# EAGLE design Venus_GPS_logger-sma (EAGLE 6.5.0)
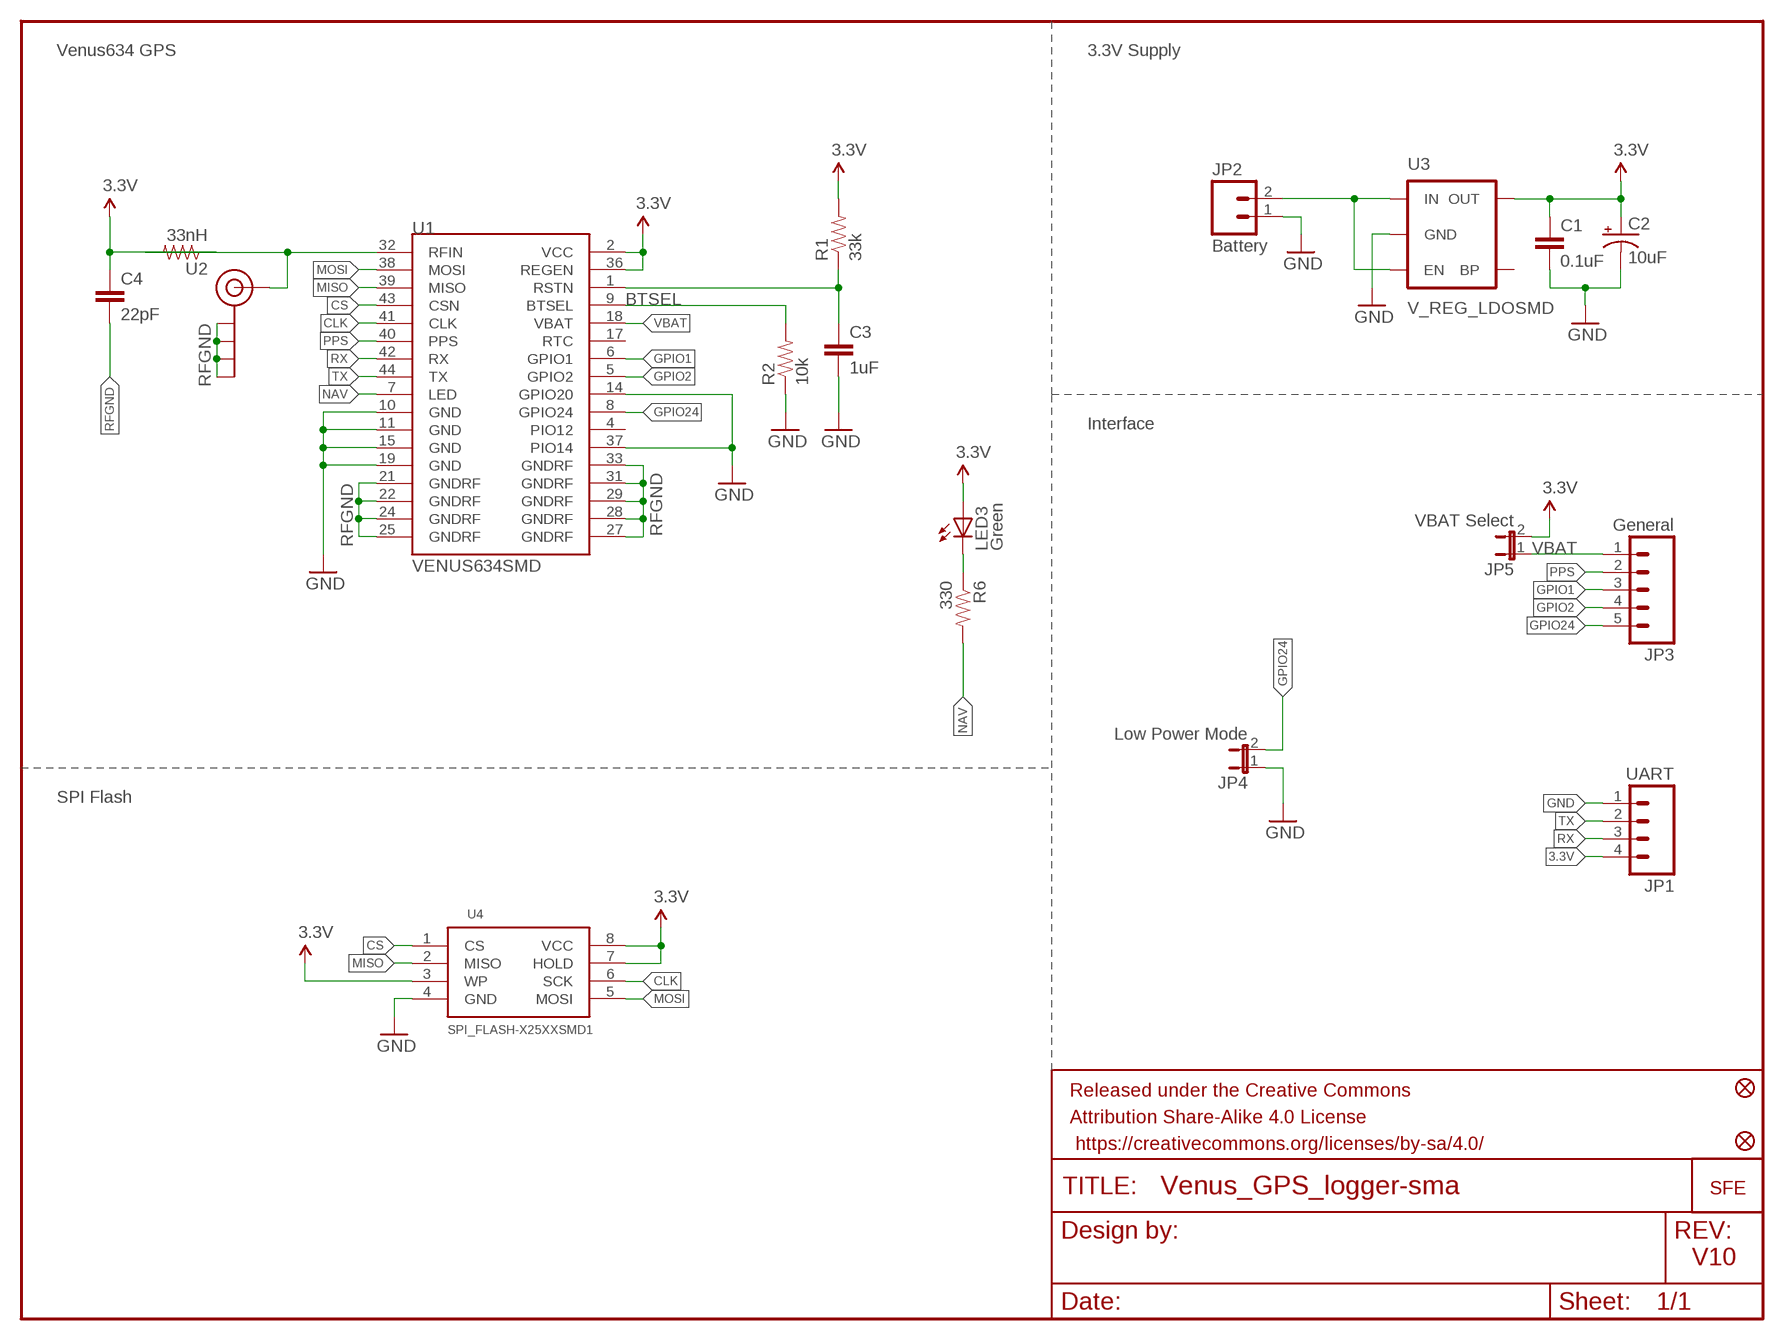
[diagram p0: schematic, sheet 1]

## Parts
C1  0.1uF  0.1UF-25V(+80/-20%)(0603)  [0603-CAP]
C2  10uF  CAP_POL1206  [EIA3216]
C3  1uF  1.0UF-16V-10%(0603)  [0603-CAP]
C4  22pF  22PF-50V-5%(0603)  [0603-CAP]
FID1  FIDUCIAL1X2  [FIDUCIAL-1X2]
FID2  FIDUCIAL1X2  [FIDUCIAL-1X2]
FRAME1  FRAME-LETTER  [CREATIVE_COMMONS]
J$1  SMA_EDGE  [SMA-EDGE]
JP1  UART  M04PTH  [1X04]
JP2  Battery  M02-JST-2MM-SMT  [S2B-PH]
JP3  General  M05PTH  [1X05]
JP4  Low Power Mode  JUMPER-2SMD-NC  [SJ_2S]
JP5  VBAT Select  JUMPER-2SMD-NC  [SJ_2S]
LED3  Green  LED-GREEN0603  [LED-0603]
R1  33k  33KOHM1/10W1%(0603)  [0603-RES]
R2  10k  10KOHM1/10W1%(0603)0603  [0603-RES]
R6  330  330OHM1/10W1%(0603)  [0603-RES]
U1  VENUS634SMD  [LGA44]
U2  33nH  33NH  [0603-RES]
U3  V_REG_LDOSMD  [SOT23-5]
U4  SPI_FLASH-X25XXSMD1  [SO08-EIAJ]
U$1  LOGO-SFESK  [SFE-LOGO-FLAME]

## Nets
3.3V: C1.1 C2.A(+) C4.1 JP1.4 JP5.2 LED3.A R1.2 U1.2(VCC) U1.36(REGEN) U2.1 U3.5(OUT) U4.3(WP) U4.7(HOLD) U4.8(VCC)
BTSEL: R2.2 U1.9(BTSEL)
CLK: U1.41(CLK) U4.6(SCK)
CS: U1.43(CSN) U4.1(CS)
GND: C1.2 C2.C(-) C3.2 JP1.1 JP2.1 JP4.1 R2.1 U1.10(GND) U1.11(GND) U1.14(GPIO20) U1.15(GND) U1.19(GND) U1.37(PIO14) U3.2(GND) U4.4(GND)
GPIO1: JP3.3 U1.6(GPIO1)
GPIO2: JP3.4 U1.5(GPIO2)
GPIO24: JP3.5 JP4.2 U1.8(GPIO24)
MISO: U1.39(MISO) U4.2(MISO)
MOSI: U1.38(MOSI) U4.5(MOSI)
N$1: LED3.C R6.1
N$3: C3.1 R1.1 U1.1(RSTN)
N$14: J$1.SIG(SIGNAL) U1.32(RFIN) U2.2
NAV: R6.2 U1.7(LED)
PPS: JP3.2 U1.40(PPS)
RFGND: C4.2 J$1.GND@0(GND) J$1.GND@1(GND) J$1.GND@2(GND) J$1.GND@3(GND) U1.21(GNDRF) U1.22(GNDRF) U1.24(GNDRF) U1.25(GNDRF) U1.27(GNDRF) U1.28(GNDRF) U1.29(GNDRF) U1.31(GNDRF) U1.33(GNDRF)
RX: JP1.3 U1.42(RX)
TX: JP1.2 U1.44(TX)
VBAT: JP3.1 JP5.1 U1.18(VBAT)
VBATT: JP2.2 U3.1(IN) U3.3(EN)
Unconnected: U1.4(PIO12) U1.17(RTC) U3.4(BP)

## Notes on the sheet
- Venus634 GPS | 3.3V Supply
- Interface
- SPI Flash
- V10

## Library data of the parts
C1 = SparkFun-Capacitors:0.1UF-25V(+80/-20%)(0603): CAP-00810 Ceramic Standard decoupling cap; PROD_ID: CAP-00810
C2 = SparkFun:CAP_POL: Capacitor Polarized These are standard SMD and PTH capacitors. Normally 10uF, 47uF, and 100uF in electrolytic and tantalum varieties. Always verify the external diameter of the through hole cap, it varies with capacity, voltage, and manufacturer. The EIA devices should be standard.
C3 = SparkFun-Capacitors:1.0UF-16V-10%(0603): CAP-00868; PROD_ID: CAP-00868; VALUE: 1.0uF
C4 = SparkFun-Capacitors:22PF-50V-5%(0603): CAP-07876; PROD_ID: CAP-07876
FID1 FID2 = SparkFun-Aesthetics:FIDUCIAL: Fiducial Alignment Points Various fiducial points for machine vision alignment.
FRAME1 = SparkFun-Aesthetics:FRAME-LETTER: Schematic Frame Standard 8.5x11 US Letter frame
J$1 = SparkFun:SMA_EDGE: SMA Antenna Connector End launch SMA connector. The paste layer has been removed so that the connector can be hand soldered onto the board after reflow.
JP1 = SparkFun-Connectors:M04: Header 4 Standard 4-pin 0.1" header. Use with straight break away headers (SKU : PRT-00116), right angle break away headers (PRT-00553), swiss pins (PRT-00743), machine pins (PRT-00117), and female headers (PRT-00115). Molex polarized connector foot print use with SKU : PRT-08231 with associated crimp pins and housings. 1MM SMD Version SKU: PRT-10208
JP2 = SparkFun:M02: Header 2 Standard 2-pin 0.1" header. Use with straight break away headers (SKU : PRT-00116), right angle break away headers (PRT-00553), swiss pins (PRT-00743), machine pins (PRT-00117), and female headers (PRT-00115). Molex polarized connector foot print use with SKU : PRT-08233 with associated crimp pins and housings.
JP3 = SparkFun-Connectors:M05: Header 5 Standard 5-pin 0.1" header. Use with straight break away headers (SKU : PRT-00116), right angle break away headers (PRT-00553), swiss pins (PRT-00743), machine pins (PRT-00117), and female headers (PRT-00115). Molex polarized connector foot print use with SKU : PRT-08230 with associated crimp pins and housings.
JP4 JP5 = SparkFun-Passives:JUMPER-2: Jumper Basic 0.1" spaced jumper. Use with breakaway headers.
LED3 = SparkFun-LED:LED-GREEN: Various green LEDs Green LEDs used in SFE Production 0603- DIO-00821 LARGE- DIO-00862 LILYPAD- DIO-09910; PROD_ID: DIO-00821; VALUE: GREEN
R1 = SparkFun-Resistors:33KOHM1/10W1%(0603): RES-08416
R2 = SparkFun-Resistors:10KOHM1/10W1%(0603): RES-00824; PROD_ID: RES-00824; VALUE: 10K
R6 = SparkFun-Resistors:330OHM1/10W1%(0603): RES-00818; PROD_ID: RES-00818
U1 = SparkFun:VENUS634: Venus634 from SkyTraq
U2 = SparkFun-Resistors:33NH; PROD_ID: NDUC-07874
U3 = SparkFun:V_REG_LDO: Voltage Regulator LDO Standard 150mA LDO voltage regulator in SOT-23 layout. Micrel part MIC5205. BP (by-pass) pin is used to lower output noise with 470pF cap.
U4 = SparkFun:SPI_FLASH-X25XX: 8pin SPI Flash series x25xx. Works with devices like W25X32 and BR25L32
U$1 = SparkFun:LOGO-SFE: Spark Fun Electronics PCB Logo This is the standard Spark Fun Electronics PCB logo.

## Board
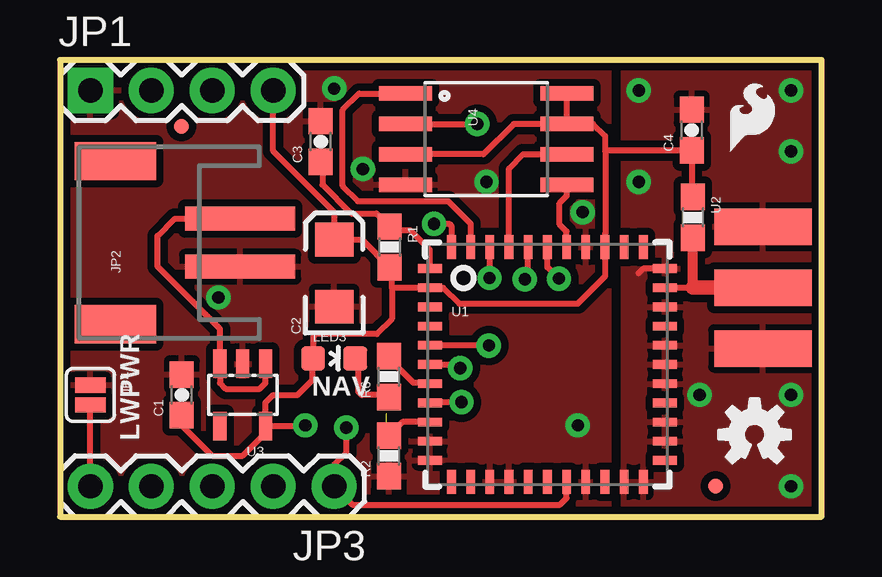
[diagram p1: board, top side]
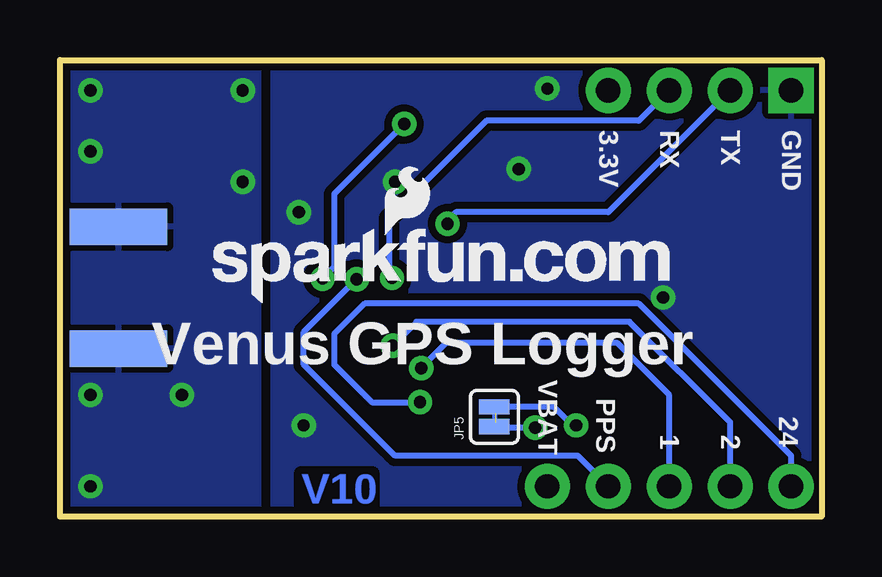
[diagram p2: board, bottom side, seen from below]

Size 31.75 x 19.05 mm. Coordinates in mm from the lower left corner, seen from the top.
Outline: 0,0 31.75,0 31.75,19.05 0,19.05 0,0
Copper layers (1*16): Top 0.035mm / dielectric 1.5mm / Bottom 0.035mm
Design rules "SparkFun-2-layer": minimum track width 7mil, minimum drill 15mil, track to track 8mil, track to pad 8mil, pad to pad 8mil, via to via 8mil, smd to smd 8mil, copper to edge 8mil, drill to drill 8mil, minimum pad ring 12mil, minimum via ring 10mil, stop-mask expansion 4mil, vias tented up to drill 20mil, thermal gap 10mil

### Footprints (pad centres in the part's own frame; a part is rotated, then mirrored left to right if it is on the bottom)
0603-CAP = smd 1.1 x 1: 1 -0.85,0; 2 0.85,0
EIA3216 = smd 1.4 x 1.6: A 1.4,0; C -1.4,0
SMA-EDGE = smd 1.524 x 4.064: GND@0 0,0; GND@1 5.08,0; SIG 2.54,0 | smd 1.524 x 4.064 bottom: GND@2 0,0; GND@3 5.08,0
1X04 = drill 1.016 pad 1.88 square: 1 0,0 | drill 1.016 pad 1.88: 2 2.54,0; 3 5.08,0; 4 7.62,0
S2B-PH = smd 1 x 4.6: 1 -1,-3.7; 2 1,-3.7 | smd 1.6 x 3.4: NC1 -3.4,1.5; NC2 3.4,1.5
1X05 = drill 1.016 pad 1.88: 1 0,0; 2 2.54,0; 3 5.08,0; 4 7.62,0; 5 10.16,0
SJ_2S = smd 0.635 x 1.27: 1 -0.412,0; 2 0.412,0
FIDUCIAL-1X2.5 = smd 0.635 x 0.635: 1 0,0
LED-0603 = smd 1 x 1: A 0,-0.877; C 0,0.877
0603-RES = smd 1.1 x 1: 1 -0.85,0; 2 0.85,0
LGA44 = smd 1 x 0.36: 1 -4.9,4; 2 -4.9,3.2; 3 -4.9,2.4; 4 -4.9,1.6; 5 -4.9,0.8; 6 -4.9,0; 7 -4.9,-0.8; 8 -4.9,-1.6; 9 -4.9,-2.4; 10 -4.9,-3.2; 11 -4.9,-4; 23 4.9,-4; 24 4.9,-3.2; 25 4.9,-2.4; 26 4.9,-1.6; 27 4.9,-0.8; 28 4.9,0; 29 4.9,0.8; 30 4.9,1.6; 31 4.9,2.4; 32 4.9,3.2; 33 4.9,4 | smd 0.36 x 1: 12 -4,-4.9; 13 -3.2,-4.9; 14 -2.4,-4.9; 15 -1.6,-4.9; 16 -0.8,-4.9; 17 0,-4.9; 18 0.8,-4.9; 19 1.6,-4.9; 20 2.4,-4.9; 21 3.2,-4.9; 22 4,-4.9; 34 4,4.9; 35 3.2,4.9; 36 2.4,4.9; 37 1.6,4.9; 38 0.8,4.9; 39 0,4.9; 40 -0.8,4.9; 41 -1.6,4.9; 42 -2.4,4.9; 43 -3.2,4.9; 44 -4,4.9
SOT23-5 = smd 0.55 x 1.2: 1 -0.95,-1.3; 2 0,-1.3; 3 0.95,-1.3; 4 0.95,1.3; 5 -0.95,1.3
SO08-EIAJ = smd 0.61 x 2.21: 1 -1.905,-3.378; 2 -0.635,-3.378; 3 0.635,-3.378; 4 1.905,-3.378; 5 1.905,3.353; 6 0.635,3.353; 7 -0.635,3.353; 8 -1.905,3.353

### Placement (x,y rotation side)
C1  5.08,5.08 90 top
C2  11.43,10.16 90 top
C3  10.87,15.65 90 top
C4  26.34,16.13 90 top
FRAME1  -88.67,0 0 top  (outside the outline)
J$1  29.31,7.01 90 top
JP1  1.27,17.78 0 top
JP2  3.81,11.43 90 top
JP3  11.43,1.27 180 top
JP4  1.27,5.08 270 top
JP5  13.64,4.17 90 bottom
JP6  FIDUCIAL1X2.5  [FIDUCIAL-1X2.5]  5.05,16.28 0 top
JP7  FIDUCIAL1X2.5  [FIDUCIAL-1X2.5]  27.33,1.27 0 top
LED3  11.43,6.6 270 top
R1  13.74,11.25 270 top
R2  13.72,2.54 90 top
R6  13.72,5.84 90 top
U1  20.32,6.35 0 top
U2  26.38,12.49 270 top
U3  7.62,5.08 180 top
U4  17.78,15.75 270 top
U$1  27.94,15.24 0 top
U$2  [OSHW-LOGO-S]  28.96,3.43 0 top
U$3  [SFE-NEW-WEBLOGO]  25.4,8.89 0 bottom

### Tracks (layer width: path | path; a pad name or v marks a point on that pad's centre or on a via)
3.3V  (via drill 0.51)
  Top 0.254: 22.73,11.82 22.72,11.81 22.73,11.8 | U4.3 17.65,15.11 18.92,16.38 U4.7 | U4.7 U4.8 | U4.7 22.23,16.38 22.73,15.88 22.73,15.24 | JP1.4 8.89,15.24 11.43,12.7 C2.A 12.58,11.56 R1.2 | C1.1 5.08,3.81 6.35,2.54 7.62,2.54 8.57,3.49 U3.5 | 13.84,10.45 13.84,10.16 13.91,10.22 | 13.84,9.55 U1.2 15.98,9.55 16.64,8.89 21.59,8.89 22.73,10.03 22.73,11.24 U1.36 22.73,11.26 22.73,11.8 | 13.84,9.55 13.84,8.26 13.21,7.62 10.67,7.62 10.55,7.5 LED3.A 10.54,5.71 9.91,5.08 8.89,5.08 8.57,4.76 U3.5 | 22.73,15.24 22.77,15.28 C4.1 26.34,13.38 U2.1 | 13.99,10.31 13.91,10.22 | 22.73,15.24 22.73,11.8 | 13.84,9.55 13.84,10.3 R1.2 | R1.2 13.74,10.39 13.91,10.22 | U3.5 10.2,3.78 v10.23,3.81
  Bottom 0.254: v10.23,3.81 10.39,3.81 11.15,4.57 JP5.2
BTSEL
  Top 0.254: U1.9 14.28,3.95 R2.2
CLK
  Top 0.254: U1.41 18.72,14.53 19.3,15.11 U4.6
CS
  Top 0.254: U1.43 17.12,12.22 16.18,13.16 12.42,13.16 11.79,13.79 11.79,16.97 12.47,17.65 U4.1 14.35,17.7
GND  (via drill 0.51)
  other vias: 17.78,13.97 21.79,12.7 11.43,17.86 21.59,3.81 12.62,14.5 6.6,9.14
  pour Bottom (isolate 0.305): 0,19.05 22.86,19.05 22.86,0 0,0
  pour Top (isolate 0.305): 0,19.05 22.86,19.05 22.86,0 0,0
GPIO1  (via drill 0.51)
  Top 0.254: U1.6 16.54,6.35 v16.69,6.2
  Bottom 0.254: 16.54,6.35 v16.69,6.2 15.65,7.24 8.51,7.24 6.35,5.08 JP3.3
GPIO2  (via drill 0.51)
  Top 0.254: U1.5 v17.87,7.15 v17.88,7.14
  Bottom 0.254: v17.88,7.14 17.86,7.11 | 17.86,7.16 v17.88,7.14 | JP3.4 3.81,3.94 8,8.13 16.89,8.13 v17.88,7.14
GPIO24  (via drill 0.51)
  Top 0.254: v16.74,4.78 15.45,4.78 U1.8 | JP3.5 JP4.2
  Bottom 0.254: v16.74,4.78 18.75,4.78 20.32,6.35 20.32,7.62 19.05,8.89 7.62,8.89 1.27,2.54 JP3.5
MISO  (via drill 0.51)
  Top 0.254: U4.2 v17.4,16.38 | U1.39 20.32,10.41 v20.8,9.93
  Bottom 0.254: v17.4,16.38 20.32,13.46 20.32,10.41 v20.8,9.93
MOSI
  Top 0.254: U1.38 21.12,11.9 20.83,12.19 20.83,13.08 21.13,13.39 U4.5
N$1
  Top 0.254: R6.1 13.63,5.08 12.57,5.08 12.45,5.21 12.45,6.46 arc90 LED3.C
N$2  (1 unrouted)
N$3
  Top 0.254: 10.77,14.7 C3.1 10.95,14.72 10.95,13.84 12.14,12.65 13.19,12.65 R1.1 13.91,11.94 14.61,11.94 15.42,11.12 U1.1
N$4
  Bottom 0.203: 13.64,4.55 13.64,3.86
N$14
  Top 0.254: U1.32 26.38,9.55
  Top 0.406: 26.38,9.55 U2.2
  Top 0.61: 26.38,9.55 J$1.SIG
NAV
  Top 0.254: 13.76,6.44 13.76,6.73 R6.2 13.72,6.6 14.73,5.59 15.38,5.59 U1.7
PPS  (via drill 0.51)
  Top 0.254: U1.40 19.52,10.05 v19.38,9.91
  Bottom 0.254: JP3.2 10.16,2.54 17.78,2.54 21.59,6.35 21.59,7.7 v19.38,9.91
RFGND  (via drill 0.51)
  Top 0.254: U1.33 24.32,10.35 24.13,10.16
  other vias: 24.13,17.78 30.48,15.24 30.48,1.27 30.48,17.78 24.13,13.97 26.67,5.08 30.48,5.08
  pour Top (isolate 0.305): 23.5,19.05 23.5,0 31.75,0 31.75,19.05
  pour Bottom (isolate 0.305): 23.5,19.05 23.5,0 31.75,0 31.75,19.05
RX  (via drill 0.51)
  Top 0.254: U1.42 17.91,11.24 v17.91,9.96
  Bottom 0.254: JP1.3 7.62,16.51 13.97,16.51 18.03,12.45 18.03,10.08 v17.91,9.96
TX  (via drill 0.51)
  Top 0.254: U1.44 16.32,12.13 16.23,12.22 v15.6,12.22
  Bottom 0.254: JP1.2 8.89,12.7 15.24,12.7 15.6,12.34 v15.6,12.22
VBAT  (via drill 0.51)
  Top 0.254: U1.18 21.12,0.78 20.85,0.51 12.19,0.51 JP3.1 11.43,2.16 11.94,2.67 v11.94,3.71
  Bottom 0.254: v11.94,3.71 13.6,3.71 JP5.1
VBATT
  Top 0.254: U3.1 8.57,5.57 8.33,5.33 6.91,5.33 6.67,5.57 U3.3 6.67,7.83 4.06,10.44 4.06,11.71 4.79,12.43 JP2.2

### Text on the board
Bottom: V10
tPlace: PWR | NAV | LW
bPlace: GND | TX | RX | 3.3V | VBAT | Venus GPS Logger | PPS | 24 | 2 | 1